# Altium schematic sheet I2C SWITCH.SchDoc
size A4 portrait
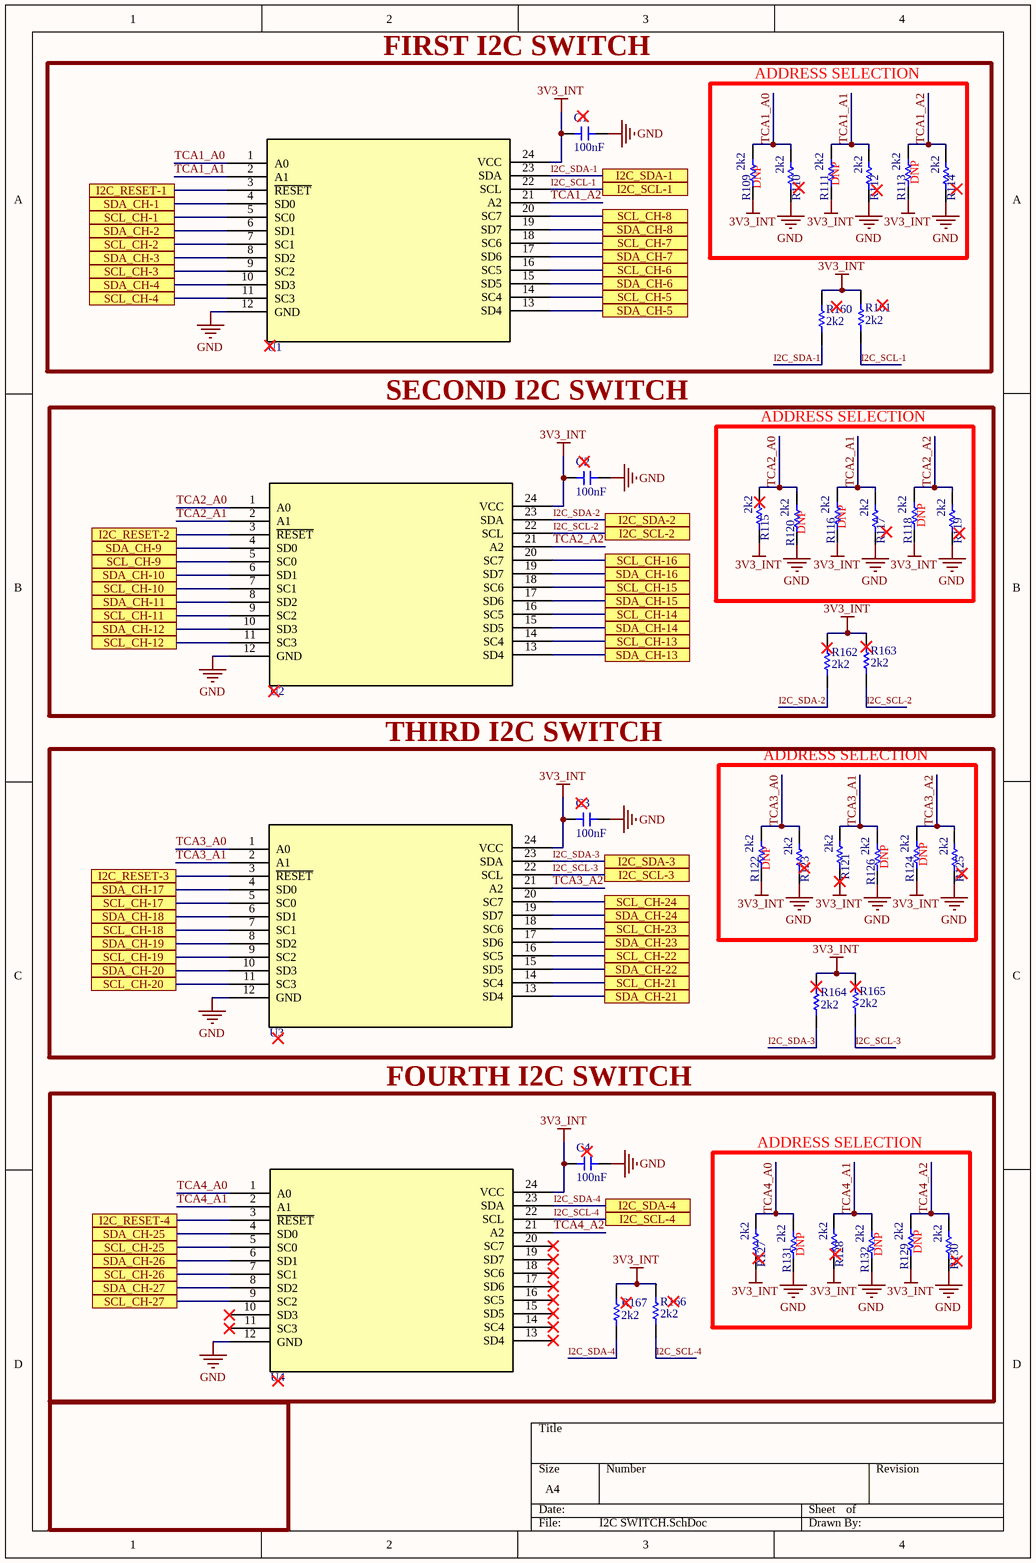
[diagram p0: I2C SWITCH.SchDoc]

## Parts
C1  value 100nF  [CAP_0402_CER]  (hidden comment: CL05B104KP5NNNC)
C2  value 100nF  [CAP_0402_CER]  (hidden comment: CL05B104KP5NNNC)
C3  value 100nF  [CAP_0402_CER]  (hidden comment: CL05B104KP5NNNC)
C4  value 100nF  [CAP_0402_CER]  (hidden comment: CL05B104KP5NNNC)
R109  value 2k2  Place: DNP  [RES_0402_SMD]  (hidden comment: RMCF0402JT2K20)  (no BOM)
R110  value 2k2  [RES_0402_SMD]  (hidden comment: RMCF0402JT2K20)
R111  value 2k2  Place: DNP  [RES_0402_SMD]  (hidden comment: RMCF0402JT2K20)  (no BOM)
R112  value 2k2  [RES_0402_SMD]  (hidden comment: RMCF0402JT2K20)
R113  value 2k2  Place: DNP  [RES_0402_SMD]  (hidden comment: RMCF0402JT2K20)  (no BOM)
R114  value 2k2  [RES_0402_SMD]  (hidden comment: RMCF0402JT2K20)
R115  value 2k2  [RES_0402_SMD]  (hidden comment: RMCF0402JT2K20)
R116  value 2k2  Place: DNP  [RES_0402_SMD]  (hidden comment: RMCF0402JT2K20)  (no BOM)
R117  value 2k2  [RES_0402_SMD]  (hidden comment: RMCF0402JT2K20)
R118  value 2k2  Place: DNP  [RES_0402_SMD]  (hidden comment: RMCF0402JT2K20)  (no BOM)
R119  value 2k2  [RES_0402_SMD]  (hidden comment: RMCF0402JT2K20)
R120  value 2k2  Place: DNP  [RES_0402_SMD]  (hidden comment: RMCF0402JT2K20)  (no BOM)
R121  value 2k2  [RES_0402_SMD]  (hidden comment: RMCF0402JT2K20)
R122  value 2k2  Place: DNP  [RES_0402_SMD]  (hidden comment: RMCF0402JT2K20)  (no BOM)
R123  value 2k2  [RES_0402_SMD]  (hidden comment: RMCF0402JT2K20)
R124  value 2k2  Place: DNP  [RES_0402_SMD]  (hidden comment: RMCF0402JT2K20)  (no BOM)
R125  value 2k2  [RES_0402_SMD]  (hidden comment: RMCF0402JT2K20)
R126  value 2k2  Place: DNP  [RES_0402_SMD]  (hidden comment: RMCF0402JT2K20)  (no BOM)
R127  value 2k2  [RES_0402_SMD]  (hidden comment: RMCF0402JT2K20)
R128  value 2k2  [RES_0402_SMD]  (hidden comment: RMCF0402JT2K20)
R129  value 2k2  Place: DNP  [RES_0402_SMD]  (hidden comment: RMCF0402JT2K20)  (no BOM)
R130  value 2k2  [RES_0402_SMD]  (hidden comment: RMCF0402JT2K20)
R131  value 2k2  Place: DNP  [RES_0402_SMD]  (hidden comment: RMCF0402JT2K20)  (no BOM)
R132  value 2k2  Place: DNP  [RES_0402_SMD]  (hidden comment: RMCF0402JT2K20)  (no BOM)
R160  value 2k2  [RES_0402_SMD]  (hidden comment: RMCF0402JT2K20)
R161  value 2k2  [RES_0402_SMD]  (hidden comment: RMCF0402JT2K20)
R162  value 2k2  [RES_0402_SMD]  (hidden comment: RMCF0402JT2K20)
R163  value 2k2  [RES_0402_SMD]  (hidden comment: RMCF0402JT2K20)
R164  value 2k2  [RES_0402_SMD]  (hidden comment: RMCF0402JT2K20)
R165  value 2k2  [RES_0402_SMD]  (hidden comment: RMCF0402JT2K20)
R166  value 2k2  [RES_0402_SMD]  (hidden comment: RMCF0402JT2K20)
R167  value 2k2  [RES_0402_SMD]  (hidden comment: RMCF0402JT2K20)
U1  TCA9548APWR  [24-TSSOP]  (value not drawn)
U2  TCA9548APWR  [24-TSSOP]  (value not drawn)
U3  TCA9548APWR  [24-TSSOP]  (value not drawn)
U4  TCA9548APWR  [24-TSSOP]  (value not drawn)

## Blocks framed on the sheet
FIRST I2C SWITCH: C1 R160 R161 U1
ADDRESS SELECTION: R109-R114
SECOND I2C SWITCH: C2 R162 R163 U2
ADDRESS SELECTION: R115-R120
THIRD I2C SWITCH: C3 R164 R165 U3
ADDRESS SELECTION: R121-R126
FOURTH I2C SWITCH: C4 R166 R167 U4
ADDRESS SELECTION: R127-R132

## Ports
I2C_RESET-1, I2C_RESET-2, I2C_RESET-3, I2C_RESET-4, I2C_SCL-1, I2C_SCL-2, I2C_SCL-3, I2C_SCL-4, I2C_SDA-1, I2C_SDA-2, I2C_SDA-3, I2C_SDA-4, SCL_CH-1, SCL_CH-2, SCL_CH-3, SCL_CH-4, SCL_CH-5, SCL_CH-6, SCL_CH-7, SCL_CH-8, SCL_CH-9, SCL_CH-10, SCL_CH-11, SCL_CH-12, SCL_CH-13, SCL_CH-14, SCL_CH-15, SCL_CH-16, SCL_CH-17, SCL_CH-18, SCL_CH-19, SCL_CH-20, SCL_CH-21, SCL_CH-22, SCL_CH-23, SCL_CH-24, SCL_CH-25, SCL_CH-26, SCL_CH-27, SDA_CH-1, SDA_CH-2, SDA_CH-3, SDA_CH-4, SDA_CH-5, SDA_CH-6, SDA_CH-7, SDA_CH-8, SDA_CH-9, SDA_CH-10, SDA_CH-11, SDA_CH-12, SDA_CH-13, SDA_CH-14, SDA_CH-15, SDA_CH-16, SDA_CH-17, SDA_CH-18, SDA_CH-19, SDA_CH-20, SDA_CH-21, SDA_CH-22, SDA_CH-23, SDA_CH-24, SDA_CH-25, SDA_CH-26, SDA_CH-27

## Nets
3V3_INT: C1.2 C2.2 C3.2 C4.2 R109.2 R111.2 R113.2 R115.2 R116.2 R118.2 R121.2 R122.2 R124.2 R127.2 R128.2 R129.2 R160.2 R161.2 R162.2 R163.2 R164.2 R165.2 R166.2 R167.2 U1.24(VCC) U2.24(VCC) U3.24(VCC) U4.24(VCC)
GND: C1.1 C2.1 C3.1 C4.1 R110.2 R112.2 R114.2 R117.2 R119.2 R120.2 R123.2 R125.2 R126.2 R130.2 R131.2 R132.2 U1.12(GND) U2.12(GND) U3.12(GND) U4.12(GND)
I2C_RESET-1: U1.3(~{RESET}) ; port I2C_RESET-1
I2C_RESET-2: U2.3(~{RESET}) ; port I2C_RESET-2
I2C_RESET-3: U3.3(~{RESET}) ; port I2C_RESET-3
I2C_RESET-4: U4.3(~{RESET}) ; port I2C_RESET-4
I2C_SCL-1: R161.1 U1.22(SCL) ; port I2C_SCL-1
I2C_SCL-2: R163.1 U2.22(SCL) ; port I2C_SCL-2
I2C_SCL-3: R165.1 U3.22(SCL) ; port I2C_SCL-3
I2C_SCL-4: R166.1 U4.22(SCL) ; port I2C_SCL-4
I2C_SDA-1: R160.1 U1.23(SDA) ; port I2C_SDA-1
I2C_SDA-2: R162.1 U2.23(SDA) ; port I2C_SDA-2
I2C_SDA-3: R164.1 U3.23(SDA) ; port I2C_SDA-3
I2C_SDA-4: R167.1 U4.23(SDA) ; port I2C_SDA-4
SCL_CH-1: U1.5(SC0) ; port SCL_CH-1
SCL_CH-2: U1.7(SC1) ; port SCL_CH-2
SCL_CH-3: U1.9(SC2) ; port SCL_CH-3
SCL_CH-4: U1.11(SC3) ; port SCL_CH-4
SCL_CH-5: U1.14(SC4) ; port SCL_CH-5
SCL_CH-6: U1.16(SC5) ; port SCL_CH-6
SCL_CH-7: U1.18(SC6) ; port SCL_CH-7
SCL_CH-8: U1.20(SC7) ; port SCL_CH-8
SCL_CH-9: U2.5(SC0) ; port SCL_CH-9
SCL_CH-10: U2.7(SC1) ; port SCL_CH-10
SCL_CH-11: U2.9(SC2) ; port SCL_CH-11
SCL_CH-12: U2.11(SC3) ; port SCL_CH-12
SCL_CH-13: U2.14(SC4) ; port SCL_CH-13
SCL_CH-14: U2.16(SC5) ; port SCL_CH-14
SCL_CH-15: U2.18(SC6) ; port SCL_CH-15
SCL_CH-16: U2.20(SC7) ; port SCL_CH-16
SCL_CH-17: U3.5(SC0) ; port SCL_CH-17
SCL_CH-18: U3.7(SC1) ; port SCL_CH-18
SCL_CH-19: U3.9(SC2) ; port SCL_CH-19
SCL_CH-20: U3.11(SC3) ; port SCL_CH-20
SCL_CH-21: U3.14(SC4) ; port SCL_CH-21
SCL_CH-22: U3.16(SC5) ; port SCL_CH-22
SCL_CH-23: U3.18(SC6) ; port SCL_CH-23
SCL_CH-24: U3.20(SC7) ; port SCL_CH-24
SCL_CH-25: U4.5(SC0) ; port SCL_CH-25
SCL_CH-26: U4.7(SC1) ; port SCL_CH-26
SCL_CH-27: U4.9(SC2) ; port SCL_CH-27
SDA_CH-1: U1.4(SD0) ; port SDA_CH-1
SDA_CH-2: U1.6(SD1) ; port SDA_CH-2
SDA_CH-3: U1.8(SD2) ; port SDA_CH-3
SDA_CH-4: U1.10(SD3) ; port SDA_CH-4
SDA_CH-5: U1.13(SD4) ; port SDA_CH-5
SDA_CH-6: U1.15(SD5) ; port SDA_CH-6
SDA_CH-7: U1.17(SD6) ; port SDA_CH-7
SDA_CH-8: U1.19(SD7) ; port SDA_CH-8
SDA_CH-9: U2.4(SD0) ; port SDA_CH-9
SDA_CH-10: U2.6(SD1) ; port SDA_CH-10
SDA_CH-11: U2.8(SD2) ; port SDA_CH-11
SDA_CH-12: U2.10(SD3) ; port SDA_CH-12
SDA_CH-13: U2.13(SD4) ; port SDA_CH-13
SDA_CH-14: U2.15(SD5) ; port SDA_CH-14
SDA_CH-15: U2.17(SD6) ; port SDA_CH-15
SDA_CH-16: U2.19(SD7) ; port SDA_CH-16
SDA_CH-17: U3.4(SD0) ; port SDA_CH-17
SDA_CH-18: U3.6(SD1) ; port SDA_CH-18
SDA_CH-19: U3.8(SD2) ; port SDA_CH-19
SDA_CH-20: U3.10(SD3) ; port SDA_CH-20
SDA_CH-21: U3.13(SD4) ; port SDA_CH-21
SDA_CH-22: U3.15(SD5) ; port SDA_CH-22
SDA_CH-23: U3.17(SD6) ; port SDA_CH-23
SDA_CH-24: U3.19(SD7) ; port SDA_CH-24
SDA_CH-25: U4.4(SD0) ; port SDA_CH-25
SDA_CH-26: U4.6(SD1) ; port SDA_CH-26
SDA_CH-27: U4.8(SD2) ; port SDA_CH-27
TCA1_A0: R109.1 R110.1 U1.1(A0)
TCA1_A1: R111.1 R112.1 U1.2(A1)
TCA1_A2: R113.1 R114.1 U1.21(A2)
TCA2_A0: R115.1 R120.1 U2.1(A0)
TCA2_A1: R116.1 R117.1 U2.2(A1)
TCA2_A2: R118.1 R119.1 U2.21(A2)
TCA3_A0: R122.1 R123.1 U3.1(A0)
TCA3_A1: R121.1 R126.1 U3.2(A1)
TCA3_A2: R124.1 R125.1 U3.21(A2)
TCA4_A0: R127.1 R131.1 U4.1(A0)
TCA4_A1: R128.1 R132.1 U4.2(A1)
TCA4_A2: R129.1 R130.1 U4.21(A2)

Not connected (* = marked no-connect by the designer): U4 10(SD3)* 11(SC3)* 13(SD4)* 14(SC4)* 15(SD5)* 16(SC5)* 17(SD6)* 18(SC6)* 19(SD7)* 20(SC7)*

## Library data of the parts
C1-C4 = CAP_GEN_CER: 100nF 0402 Ceramic Capacitor; Voltage: 10V; Place: POP; Part Number: CL05B104KP5NNNC; Power: *; Package: *; Tolerance: *; Operating Temp.: *
R109 R111 R113 R116 R118 R120 R122 R124 R126 R129 R131 R132 = RES_GEN_SMD: Generic Chip Res 2k2; Tolerance: 5 %; Package: *; Part Number: RMCF0402JT2K20; Power: *; Voltage: *; Operating Temp.: *
R110 R112 R114 R115 R117 R119 R121 R123 R125 R127 R128 R130 R160-R167 = RES_GEN_SMD: Generic Chip Res 2k2; Tolerance: 5 %; Place: POP; Package: *; Part Number: RMCF0402JT2K20; Power: *; Voltage: *; Operating Temp.: *
U1-U4 = TCA9548APWR: IC BUS SWITCH 1 X 8:1 24TSSOP; Manufacturer: Texas Instruments; Place: P; Part Number: TCA9548APWR; Operating Temp.: -40°C ~ 85°C; Power: N/A; Tolerance: N/A; Value: N/A; Voltage: N/A; Package: 24-TSSOP